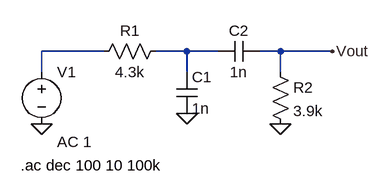
[diagram p0: schematic Bandpass filter ultrasound.asc]
Bandpass filter ultrasound.asc, the LTspice schematic file:
Version 4.1
SHEET 1 880 680
WIRE 64 64 -32 64
WIRE 192 64 144 64
WIRE 240 64 192 64
WIRE 336 64 304 64
WIRE 416 64 336 64
WIRE -32 96 -32 64
WIRE 192 96 192 64
WIRE 336 96 336 64
FLAG 416 64 Vout
FLAG 336 176 0
FLAG 192 160 0
FLAG -32 176 0
SYMBOL res 160 48 R90
WINDOW 0 0 56 VBottom 2
WINDOW 3 32 56 VTop 2
SYMATTR InstName R1
SYMATTR Value 4.3k
SYMBOL cap 176 96 R0
SYMATTR InstName C1
SYMATTR Value 1n
SYMBOL cap 304 48 R90
WINDOW 0 0 32 VBottom 2
WINDOW 3 32 32 VTop 2
SYMATTR InstName C2
SYMATTR Value 1n
SYMBOL res 320 80 R0
SYMATTR InstName R2
SYMATTR Value 3.9k
SYMBOL voltage -32 80 R0
WINDOW 123 24 124 Left 2
WINDOW 39 0 0 Left 0
SYMATTR Value2 AC 1
SYMATTR InstName V1
SYMATTR Value ""
TEXT -64 240 Left 2 !.ac dec 100 10 100k

The netlist it stands for:
* Bandpass filter ultrasound.asc
R1 N002 N001 4.3k
C1 N002 0 1n
C2 Vout N002 1n
R2 Vout 0 3.9k
V1 N001 0 AC 1
.ac dec 100 10 100k
.backanno
.end